# EAGLE design untitled (EAGLE 5.10)
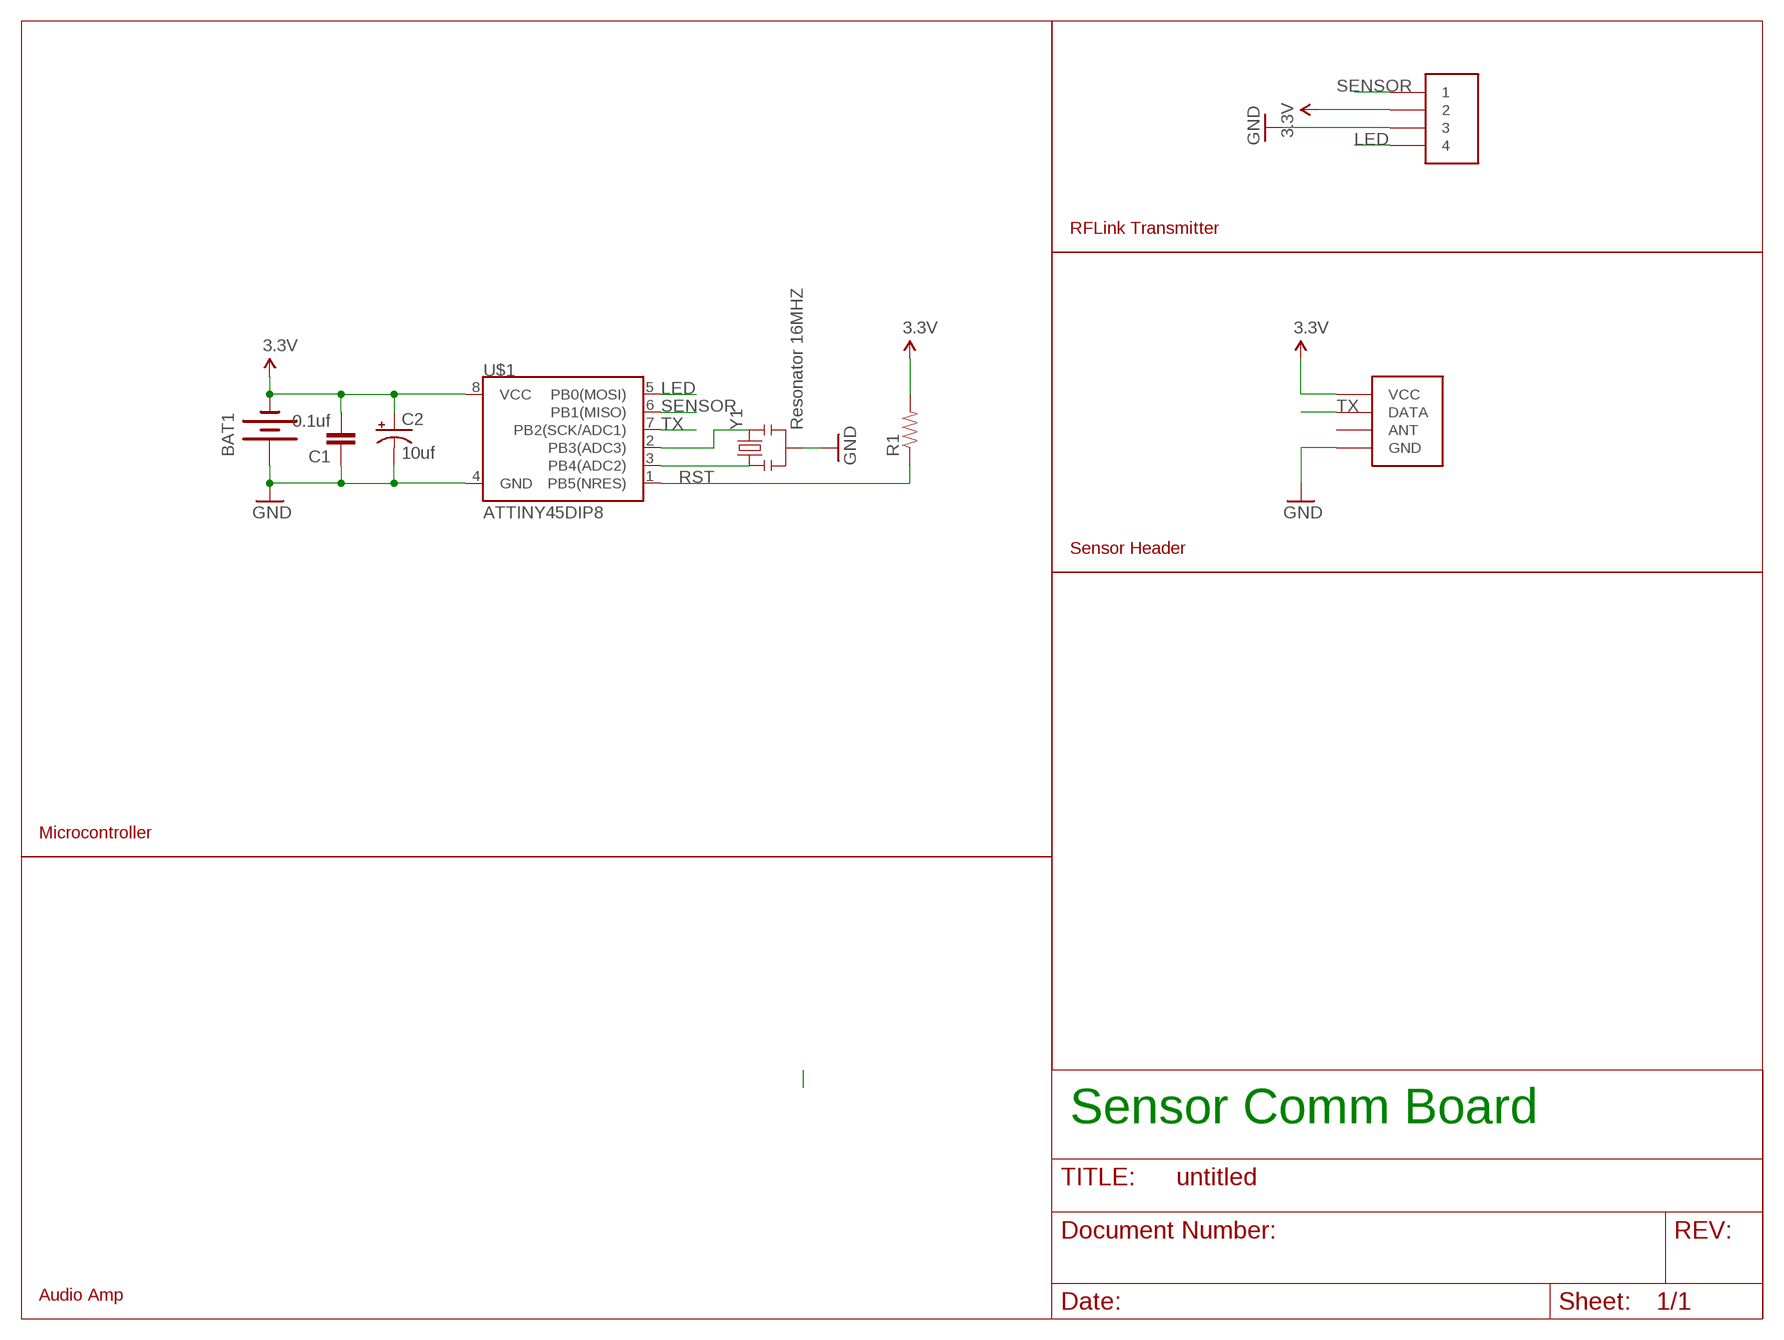
[diagram p0: schematic, sheet 1]

## Parts
BAT1  BATTERY245PTH  [BATTCON_245MM_PTH]
C1  0.1uf  CAPPTH  [CAP-PTH-SMALL]
C2  10uf  CAP_POLPTH2  [CPOL-RADIAL-10UF-25V]
R1  RESISTORPTH-1/4W  [AXIAL-0.4]
RFLINK  RFLINK-TX  [RFLINK-TX]
SENSOR  4HEAD  [4HEAD]
U$1  ATTINY45DIP8  [DIP08]
Y1  Resonator 16MHZ  RESONATORPTH  [RESONATOR-PTH]

## Nets
3.3V: BAT1.2(-) C1.2 C2.1(+) R1.P$2 RFLINK.3(VCC) SENSOR.2 U$1.8(VCC)
GND: BAT1.3(+) C1.1 C2.2(-) RFLINK.1(GND) SENSOR.3 U$1.4(GND) Y1.2
LED: SENSOR.4 U$1.5(PB0(MOSI))
N$1: U$1.2(PB3(ADC3)) Y1.3
N$2: U$1.3(PB4(ADC2)) Y1.1
RST: R1.P$1 U$1.1(PB5(NRES))
SENSOR: SENSOR.1 U$1.6(PB1(MISO))
TX: RFLINK.2(DATA) U$1.7(PB2(SCK/ADC1))
Unconnected: RFLINK.4(ANT)

## Notes on the sheet
- RFLink Transmitter
- Sensor Header
- Microcontroller
- Sensor Comm Board
- Audio Amp

## Library data of the parts
BAT1 = sparkfun:BATTERY: Battery Holders Various common sizes : AA, AAA, 20mm coin cell and 12mm coin cell.
C1 = sparkfun:CAP: Capacitor Standard 0603 ceramic capacitor, and 0.1" leaded capacitor.
C2 = sparkfun:CAP_POL: Capacitor Polarized These are standard SMD and PTH capacitors. Normally 10uF, 47uF, and 100uF in electrolytic and tantalum varieties. Always verify the external diameter of the through hole cap, it varies with capacity, voltage, and manufacturer. The EIA devices should be standard.
R1 = sparkfun:RESISTOR: Resistor Basic schematic elements and footprints for 0603, 1206, and PTH resistors.
RFLINK = custom:RFLINK-TX
SENSOR = custom:4HEAD
U$1 = sparkfun:ATTINY45: Atmel ATTiny45
Y1 = sparkfun:RESONATOR: Resonator Small SMD resonator. This is the itty bitty 10/20MHz resonators with built in caps. CSTCE10M0G55 and CSTCE20M0V53. Footprint has been reviewed closely but hasn't been tested yet.

## Board
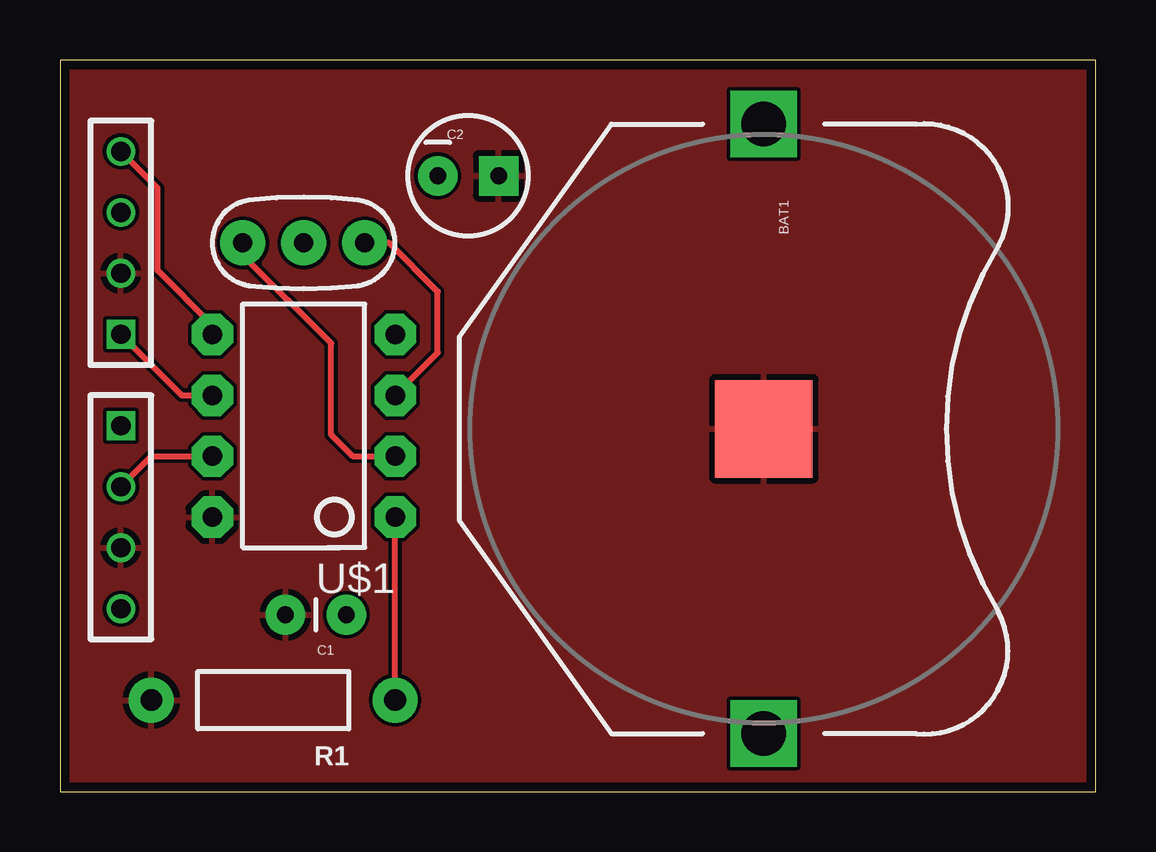
[diagram p1: board, top side]
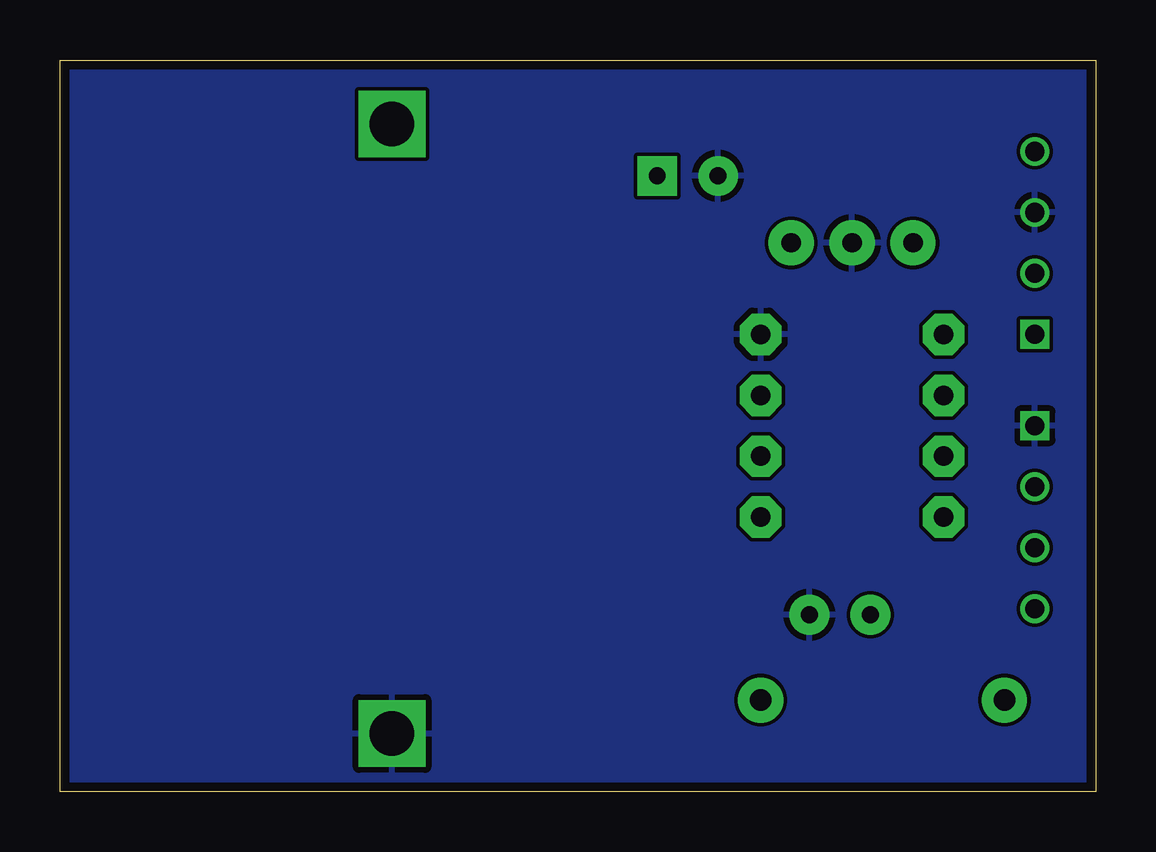
[diagram p2: board, bottom side, seen from below]

Size 43.18 x 30.48 mm. Coordinates in mm from the lower left corner, seen from the top.
Outline: 0,0 43.18,0 43.18,30.48 0,30.47 0,0
Copper layers (1*16): Top 0.0356mm / dielectric 1.5011mm / Bottom 0.0356mm
Design rules "LaenPCBOrder": minimum track width 6mil, minimum drill 13mil, track to track 6mil, track to pad 6mil, pad to pad 6mil, via to via 6mil, smd to smd 6mil, copper to edge 15mil, drill to drill 6mil, minimum pad ring 7mil, minimum via ring 7mil, stop-mask expansion 4mil, vias tented up to drill 0mil, thermal gap 10mil

### Footprints (pad centres in the part's own frame; a part is rotated, then mirrored left to right if it is on the bottom)
BATTCON_245MM_PTH = drill 1.854 square: 1 -12.7,0; 3 12.7,0 | smd 4.064 x 4.064: 2 0,0
CAP-PTH-SMALL = drill 0.7 pad 1.651 round: 1 0,0; 2 2.54,0
CPOL-RADIAL-10UF-25V = drill 0.7 pad 1.651 square: 1 1.27,0 | drill 0.7 pad 1.651 round: 2 -1.27,0
AXIAL-0.4 = drill 0.9 pad 1.88 round: P$1 -5.08,0; P$2 5.08,0
RFLINK-TX = drill 0.8 square: 1 -3.81,0 | drill 0.8 round: 2 -1.27,0; 3 1.27,0; 4 3.81,0
4HEAD = drill 0.8 square: 1 -3.81,0 | drill 0.8 round: 2 -1.27,0; 3 1.27,0; 4 3.81,0
DIP08 = drill 0.813 pad 1.727 octagon: 1 -3.81,-3.81; 2 -1.27,-3.81; 3 1.27,-3.81; 4 3.81,-3.81; 5 3.81,3.81; 6 1.27,3.81; 7 -1.27,3.81; 8 -3.81,3.81
RESONATOR-PTH = drill 0.8 pad 1.88 round: 1 -2.54,0; 2 0,0; 3 2.54,0

### Placement (x,y rotation side)
BAT1  29.34,15.11 270 top
C1  11.94,7.37 180 top
C2  17.02,25.65 0 top
R1  8.89,3.81 180 top
RFLINK  2.54,11.43 270 bottom
SENSOR  2.54,22.86 90 top
U$1  10.16,15.24 90 top
Y1  10.16,22.86 180 top

### Tracks (layer width: path | path; a pad name or v marks a point on that pad's centre or on a via)
3.3V
  pour Top: 0,30.48 43.18,30.48 43.18,0 0,0
GND
  pour Bottom: 0,30.48 43.18,30.48 43.18,0 0,0
LED
  Top 0.254: U$1.5 6.35,19.43 4.06,21.72 4.06,25.15 SENSOR.4
N$1
  Top 0.254: Y1.3 7.62,22.35 11.3,18.67 11.3,14.86 12.19,13.97 U$1.2
N$2
  Top 0.254: Y1.1 13.72,22.86 15.75,20.83 15.75,18.29 U$1.3
RST
  Top 0.254: R1.P$1 U$1.1
SENSOR
  Top 0.254: U$1.6 5.08,16.51 SENSOR.1
TX
  Top 0.254: U$1.7 3.81,13.97 RFLINK.2